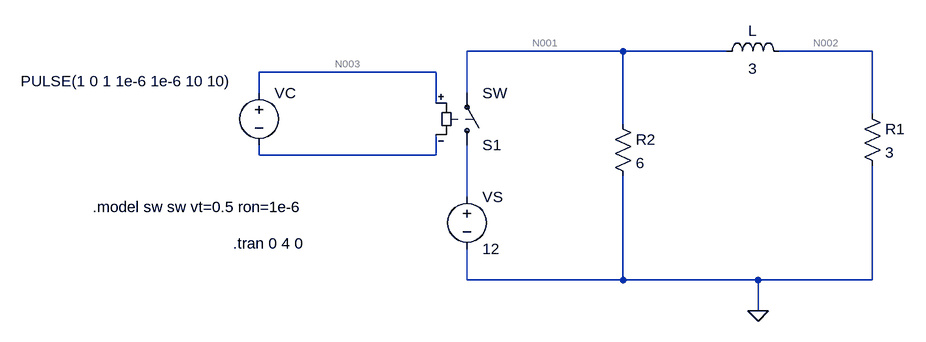
[diagram p0: schematic exercise1.asc]
exercise1.asc, the LTspice schematic file:
Version 4
SHEET 1 1032 680
WIRE 592 64 352 64
WIRE 752 64 592 64
WIRE 976 64 832 64
WIRE 304 96 32 96
WIRE 32 128 32 96
WIRE 352 128 352 64
WIRE 304 144 304 96
WIRE 976 160 976 64
WIRE 592 176 592 64
WIRE 32 224 32 208
WIRE 304 224 304 192
WIRE 304 224 32 224
WIRE 352 288 352 208
WIRE 352 416 352 368
WIRE 592 416 592 256
WIRE 592 416 352 416
WIRE 800 416 592 416
WIRE 976 416 976 240
WIRE 976 416 800 416
WIRE 800 464 800 416
FLAG 800 464 0
SYMBOL voltage 32 112 R0
WINDOW 3 -367 -2 Left 2
WINDOW 123 0 0 Left 0
WINDOW 39 0 0 Left 0
SYMATTR InstName VC
SYMATTR Value PULSE(1 0 1 1e-6 1e-6 10 10)
SYMBOL sw 352 224 M180
SYMATTR InstName S1
SYMBOL voltage 352 272 R0
WINDOW 123 0 0 Left 0
WINDOW 39 0 0 Left 0
SYMATTR InstName VS
SYMATTR Value 12
SYMBOL ind 736 80 R270
WINDOW 0 32 56 VTop 2
WINDOW 3 5 56 VBottom 2
SYMATTR InstName L
SYMATTR Value 3
SYMBOL res 960 144 R0
SYMATTR InstName R1
SYMATTR Value 3
SYMBOL res 576 160 R0
SYMATTR InstName R2
SYMATTR Value 6
TEXT -224 304 Left 2 !.model sw sw vt=0.5 ron=1e-6
TEXT -8 360 Left 2 !.tran 0 4 0

The netlist it stands for:
* exercise1.asc
VC N003 N004 PULSE(1 0 1 1e-6 1e-6 10 10)
S1 N005 N001 N003 N004 SW
VS N005 0 12
L N001 N002 3
R1 N002 0 3
R2 N001 0 6
.model sw sw vt=0.5 ron=1e-6
.tran 0 4 0
.backanno
.end

* Results of the author's LTspice run, read from the files saved beside the schematic
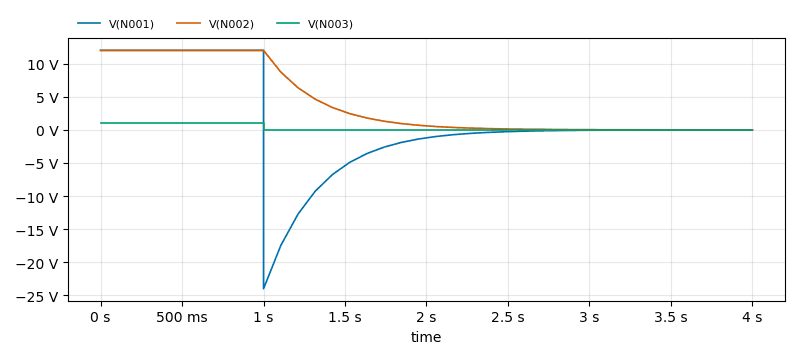
[diagram p1: Transient Analysis of exercise1.asc, plotted from the saved traces]
* Transient Analysis, 1 run:
*   V(N001): min -23.99 V, max 12 V, average 984.4 mV, rms 7.796 V, last -2.958 mV
*   V(N002): min 1.479 mV, max 12 V, average 4.007 V, rms 6.494 V, last 1.479 mV
*   V(N003): min 0 V, max 1 V, average 250 mV, rms 500 mV, last 0 V